# Altium schematic sheet RK3566_DDR_PHY.SchDoc
size A4; SheetNumber: 16; SheetTotal: 20
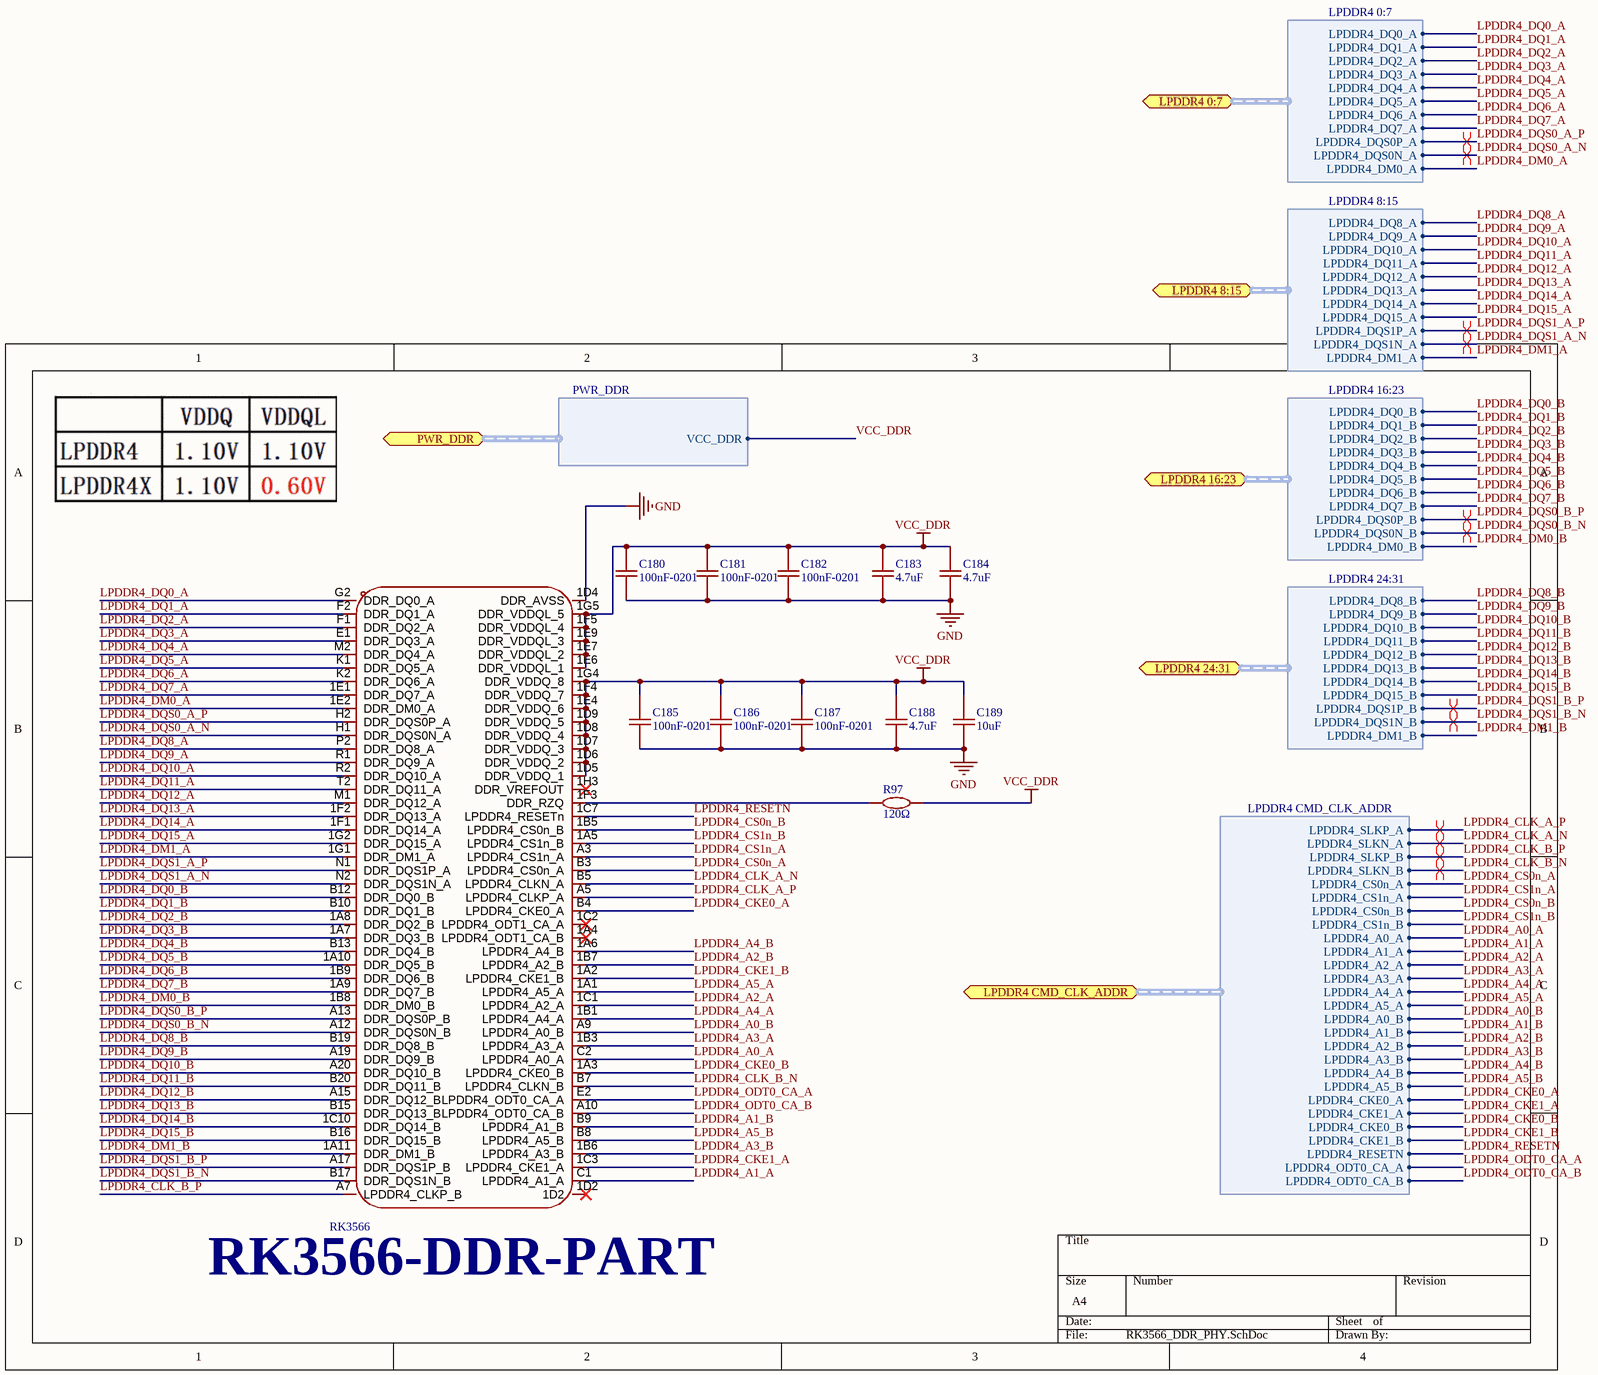
[diagram p0: RK3566_DDR_PHY.SchDoc]

## Parts
C180  100nF-0201  [C0201]
C181  100nF-0201  [C0201]
C182  100nF-0201  [C0201]
C183  4.7uF  [C0402]
C184  4.7uF  [C0402]
C185  100nF-0201  [C0201]
C186  100nF-0201  [C0201]
C187  100nF-0201  [C0201]
C188  4.7uF  [C0402]
C189  10uF  [C0603]
R97  120Ω  [R0402]
U2  RK3566  [BGA-565_L15.5-W14.4-P0.40_RK3566_1]  (part C of 8)

## Ports
LPDDR4 0:7 (bidir, harness LPDDR4 0:7, see RK3566[2A], LPDDR4[7A], RK3566[2A]), LPDDR4 8:15 (bidir, harness LPDDR4 8:15, see RK3566[2A], LPDDR4[7A], RK3566[2A]), LPDDR4 16:23 (bidir, harness LPDDR4 16:23, see RK3566[2A], LPDDR4[7B], RK3566[2A]), LPDDR4 24:31 (bidir, harness LPDDR4 24:31, see RK3566[2A], LPDDR4[7B], RK3566[2A]), LPDDR4 CMD_CLK_ADDR (bidir, harness LPDDR4 CMD_CLK_ADDR, see RK3566[2A], LPDDR4[6C], RK3566[2A]), PWR_DDR (bidir, harness PWR_DDR, see RK3566[2A], POWER[3D], POWER_FLASH_POWER_MANAGE[3B], POWER_PMIC[2D], RK3566[2A])

## Harnesses
PWR_DDR: VCC_DDR
LPDDR4 0:7: LPDDR4_DQ0_A, LPDDR4_DQ1_A, LPDDR4_DQ2_A, LPDDR4_DQ3_A, LPDDR4_DQ4_A, LPDDR4_DQ5_A, LPDDR4_DQ6_A, LPDDR4_DQ7_A, LPDDR4_DQS0P_A, LPDDR4_DQS0N_A, LPDDR4_DM0_A
LPDDR4 8:15: LPDDR4_DQ8_A, LPDDR4_DQ9_A, LPDDR4_DQ10_A, LPDDR4_DQ11_A, LPDDR4_DQ12_A, LPDDR4_DQ13_A, LPDDR4_DQ14_A, LPDDR4_DQ15_A, LPDDR4_DQS1P_A, LPDDR4_DQS1N_A, LPDDR4_DM1_A
LPDDR4 16:23: LPDDR4_DQ0_B, LPDDR4_DQ1_B, LPDDR4_DQ2_B, LPDDR4_DQ3_B, LPDDR4_DQ4_B, LPDDR4_DQ5_B, LPDDR4_DQ6_B, LPDDR4_DQ7_B, LPDDR4_DQS0P_B, LPDDR4_DQS0N_B, LPDDR4_DM0_B
LPDDR4 24:31: LPDDR4_DQ8_B, LPDDR4_DQ9_B, LPDDR4_DQ10_B, LPDDR4_DQ11_B, LPDDR4_DQ12_B, LPDDR4_DQ13_B, LPDDR4_DQ14_B, LPDDR4_DQ15_B, LPDDR4_DQS1P_B, LPDDR4_DQS1N_B, LPDDR4_DM1_B
LPDDR4 CMD_CLK_ADDR: LPDDR4_SLKP_A, LPDDR4_SLKN_A, LPDDR4_SLKP_B, LPDDR4_SLKN_B, LPDDR4_CS0n_A, LPDDR4_CS1n_A, LPDDR4_CS0n_B, LPDDR4_CS1n_B, LPDDR4_A0_A, LPDDR4_A1_A, LPDDR4_A2_A, LPDDR4_A3_A, LPDDR4_A4_A, LPDDR4_A5_A, LPDDR4_A0_B, LPDDR4_A1_B, LPDDR4_A2_B, LPDDR4_A3_B, LPDDR4_A4_B, LPDDR4_A5_B, LPDDR4_CKE0_A, LPDDR4_CKE1_A, LPDDR4_CKE0_B, LPDDR4_CKE1_B, LPDDR4_RESETN, LPDDR4_ODT0_CA_A, LPDDR4_ODT0_CA_B

## Nets
GND: C180.1 C181.1 C182.1 C183.1 C184.1 C185.1 C186.1 C187.1 C188.1 C189.1 U2.1D4(DDR_AVSS)
VCC_DDR: C180.2 C181.2 C182.2 C183.2 C184.2 C185.2 C186.2 C187.2 C188.2 C189.2 R97.2 U2.1D5(DDR_VDDQ_1) U2.1D6(DDR_VDDQ_2) U2.1D7(DDR_VDDQ_3) U2.1D8(DDR_VDDQ_4) U2.1D9(DDR_VDDQ_5) U2.1E4(DDR_VDDQ_6) U2.1E6(DDR_VDDQL_1) U2.1E7(DDR_VDDQL_2) U2.1E9(DDR_VDDQL_3) U2.1F4(DDR_VDDQ_7) U2.1F5(DDR_VDDQL_4) U2.1G4(DDR_VDDQ_8) U2.1G5(DDR_VDDQL_5) ; port PWR_DDR.VCC_DDR
LPDDR4_A0_A: U2.C2(LPDDR4_A0_A) ; port LPDDR4 CMD_CLK_ADDR.LPDDR4_A0_A
LPDDR4_A0_B: U2.A9(LPDDR4_A0_B) ; port LPDDR4 CMD_CLK_ADDR.LPDDR4_A0_B
LPDDR4_A1_A: U2.C1(LPDDR4_A1_A) ; port LPDDR4 CMD_CLK_ADDR.LPDDR4_A1_A
LPDDR4_A1_B: U2.B9(LPDDR4_A1_B) ; port LPDDR4 CMD_CLK_ADDR.LPDDR4_A1_B
LPDDR4_A2_A: U2.1C1(LPDDR4_A2_A) ; port LPDDR4 CMD_CLK_ADDR.LPDDR4_A2_A
LPDDR4_A2_B: U2.1B7(LPDDR4_A2_B) ; port LPDDR4 CMD_CLK_ADDR.LPDDR4_A2_B
LPDDR4_A3_A: U2.1B3(LPDDR4_A3_A) ; port LPDDR4 CMD_CLK_ADDR.LPDDR4_A3_A
LPDDR4_A3_B: U2.1B6(LPDDR4_A3_B) ; port LPDDR4 CMD_CLK_ADDR.LPDDR4_A3_B
LPDDR4_A4_A: U2.1B1(LPDDR4_A4_A) ; port LPDDR4 CMD_CLK_ADDR.LPDDR4_A4_A
LPDDR4_A4_B: U2.1A6(LPDDR4_A4_B) ; port LPDDR4 CMD_CLK_ADDR.LPDDR4_A4_B
LPDDR4_A5_A: U2.1A1(LPDDR4_A5_A) ; port LPDDR4 CMD_CLK_ADDR.LPDDR4_A5_A
LPDDR4_A5_B: U2.B8(LPDDR4_A5_B) ; port LPDDR4 CMD_CLK_ADDR.LPDDR4_A5_B
LPDDR4_CKE0_A: U2.B4(LPDDR4_CKE0_A) ; port LPDDR4 CMD_CLK_ADDR.LPDDR4_CKE0_A
LPDDR4_CKE0_B: U2.1A3(LPDDR4_CKE0_B) ; port LPDDR4 CMD_CLK_ADDR.LPDDR4_CKE0_B
LPDDR4_CKE1_A: U2.1C3(LPDDR4_CKE1_A) ; port LPDDR4 CMD_CLK_ADDR.LPDDR4_CKE1_A
LPDDR4_CKE1_B: U2.1A2(LPDDR4_CKE1_B) ; port LPDDR4 CMD_CLK_ADDR.LPDDR4_CKE1_B
LPDDR4_CLK_A_N: U2.B5(LPDDR4_CLKN_A) ; port LPDDR4 CMD_CLK_ADDR.LPDDR4_SLKN_A
LPDDR4_CLK_A_P: U2.A5(LPDDR4_CLKP_A) ; port LPDDR4 CMD_CLK_ADDR.LPDDR4_SLKP_A
LPDDR4_CLK_B_N: U2.B7(LPDDR4_CLKN_B) ; port LPDDR4 CMD_CLK_ADDR.LPDDR4_SLKN_B
LPDDR4_CLK_B_P: U2.A7(LPDDR4_CLKP_B) ; port LPDDR4 CMD_CLK_ADDR.LPDDR4_SLKP_B
LPDDR4_CS0n_A: U2.B3(LPDDR4_CS0n_A) ; port LPDDR4 CMD_CLK_ADDR.LPDDR4_CS0n_A
LPDDR4_CS0n_B: U2.1B5(LPDDR4_CS0n_B) ; port LPDDR4 CMD_CLK_ADDR.LPDDR4_CS0n_B
LPDDR4_CS1n_A: U2.A3(LPDDR4_CS1n_A) ; port LPDDR4 CMD_CLK_ADDR.LPDDR4_CS1n_A
LPDDR4_CS1n_B: U2.1A5(LPDDR4_CS1n_B) ; port LPDDR4 CMD_CLK_ADDR.LPDDR4_CS1n_B
LPDDR4_DM0_A: U2.1E2(DDR_DM0_A) ; port LPDDR4 0:7.LPDDR4_DM0_A
LPDDR4_DM0_B: U2.1B8(DDR_DM0_B) ; port LPDDR4 16:23.LPDDR4_DM0_B
LPDDR4_DM1_A: U2.1G1(DDR_DM1_A) ; port LPDDR4 8:15.LPDDR4_DM1_A
LPDDR4_DM1_B: U2.1A11(DDR_DM1_B) ; port LPDDR4 24:31.LPDDR4_DM1_B
LPDDR4_DQ0_A: U2.G2(DDR_DQ0_A) ; port LPDDR4 0:7.LPDDR4_DQ0_A
LPDDR4_DQ0_B: U2.B12(DDR_DQ0_B) ; port LPDDR4 16:23.LPDDR4_DQ0_B
LPDDR4_DQ1_A: U2.F2(DDR_DQ1_A) ; port LPDDR4 0:7.LPDDR4_DQ1_A
LPDDR4_DQ1_B: U2.B10(DDR_DQ1_B) ; port LPDDR4 16:23.LPDDR4_DQ1_B
LPDDR4_DQ2_A: U2.F1(DDR_DQ2_A) ; port LPDDR4 0:7.LPDDR4_DQ2_A
LPDDR4_DQ2_B: U2.1A8(DDR_DQ2_B) ; port LPDDR4 16:23.LPDDR4_DQ2_B
LPDDR4_DQ3_A: U2.E1(DDR_DQ3_A) ; port LPDDR4 0:7.LPDDR4_DQ3_A
LPDDR4_DQ3_B: U2.1A7(DDR_DQ3_B) ; port LPDDR4 16:23.LPDDR4_DQ3_B
LPDDR4_DQ4_A: U2.M2(DDR_DQ4_A) ; port LPDDR4 0:7.LPDDR4_DQ4_A
LPDDR4_DQ4_B: U2.B13(DDR_DQ4_B) ; port LPDDR4 16:23.LPDDR4_DQ4_B
LPDDR4_DQ5_A: U2.K1(DDR_DQ5_A) ; port LPDDR4 0:7.LPDDR4_DQ5_A
LPDDR4_DQ5_B: U2.1A10(DDR_DQ5_B) ; port LPDDR4 16:23.LPDDR4_DQ5_B
LPDDR4_DQ6_A: U2.K2(DDR_DQ6_A) ; port LPDDR4 0:7.LPDDR4_DQ6_A
LPDDR4_DQ6_B: U2.1B9(DDR_DQ6_B) ; port LPDDR4 16:23.LPDDR4_DQ6_B
LPDDR4_DQ7_A: U2.1E1(DDR_DQ7_A) ; port LPDDR4 0:7.LPDDR4_DQ7_A
LPDDR4_DQ7_B: U2.1A9(DDR_DQ7_B) ; port LPDDR4 16:23.LPDDR4_DQ7_B
LPDDR4_DQ8_A: U2.P2(DDR_DQ8_A) ; port LPDDR4 8:15.LPDDR4_DQ8_A
LPDDR4_DQ8_B: U2.B19(DDR_DQ8_B) ; port LPDDR4 24:31.LPDDR4_DQ8_B
LPDDR4_DQ9_A: U2.R1(DDR_DQ9_A) ; port LPDDR4 8:15.LPDDR4_DQ9_A
LPDDR4_DQ9_B: U2.A19(DDR_DQ9_B) ; port LPDDR4 24:31.LPDDR4_DQ9_B
LPDDR4_DQ10_A: U2.R2(DDR_DQ10_A) ; port LPDDR4 8:15.LPDDR4_DQ10_A
LPDDR4_DQ10_B: U2.A20(DDR_DQ10_B) ; port LPDDR4 24:31.LPDDR4_DQ10_B
LPDDR4_DQ11_A: U2.T2(DDR_DQ11_A) ; port LPDDR4 8:15.LPDDR4_DQ11_A
LPDDR4_DQ11_B: U2.B20(DDR_DQ11_B) ; port LPDDR4 24:31.LPDDR4_DQ11_B
LPDDR4_DQ12_A: U2.M1(DDR_DQ12_A) ; port LPDDR4 8:15.LPDDR4_DQ12_A
LPDDR4_DQ12_B: U2.A15(DDR_DQ12_B) ; port LPDDR4 24:31.LPDDR4_DQ12_B
LPDDR4_DQ13_A: U2.1F2(DDR_DQ13_A) ; port LPDDR4 8:15.LPDDR4_DQ13_A
LPDDR4_DQ13_B: U2.B15(DDR_DQ13_B) ; port LPDDR4 24:31.LPDDR4_DQ13_B
LPDDR4_DQ14_A: U2.1F1(DDR_DQ14_A) ; port LPDDR4 8:15.LPDDR4_DQ14_A
LPDDR4_DQ14_B: U2.1C10(DDR_DQ14_B) ; port LPDDR4 24:31.LPDDR4_DQ14_B
LPDDR4_DQ15_A: U2.1G2(DDR_DQ15_A) ; port LPDDR4 8:15.LPDDR4_DQ15_A
LPDDR4_DQ15_B: U2.B16(DDR_DQ15_B) ; port LPDDR4 24:31.LPDDR4_DQ15_B
LPDDR4_DQS0_A_N: U2.H1(DDR_DQS0N_A) ; port LPDDR4 0:7.LPDDR4_DQS0N_A
LPDDR4_DQS0_A_P: U2.H2(DDR_DQS0P_A) ; port LPDDR4 0:7.LPDDR4_DQS0P_A
LPDDR4_DQS0_B_N: U2.A12(DDR_DQS0N_B) ; port LPDDR4 16:23.LPDDR4_DQS0N_B
LPDDR4_DQS0_B_P: U2.A13(DDR_DQS0P_B) ; port LPDDR4 16:23.LPDDR4_DQS0P_B
LPDDR4_DQS1_A_N: U2.N2(DDR_DQS1N_A) ; port LPDDR4 8:15.LPDDR4_DQS1N_A
LPDDR4_DQS1_A_P: U2.N1(DDR_DQS1P_A) ; port LPDDR4 8:15.LPDDR4_DQS1P_A
LPDDR4_DQS1_B_N: U2.B17(DDR_DQS1N_B) ; port LPDDR4 24:31.LPDDR4_DQS1N_B
LPDDR4_DQS1_B_P: U2.A17(DDR_DQS1P_B) ; port LPDDR4 24:31.LPDDR4_DQS1P_B
LPDDR4_ODT0_CA_A: U2.E2(LPDDR4_ODT0_CA_A) ; port LPDDR4 CMD_CLK_ADDR.LPDDR4_ODT0_CA_A
LPDDR4_ODT0_CA_B: U2.A10(LPDDR4_ODT0_CA_B) ; port LPDDR4 CMD_CLK_ADDR.LPDDR4_ODT0_CA_B
LPDDR4_RESETN: U2.1C7(LPDDR4_RESETn) ; port LPDDR4 CMD_CLK_ADDR.LPDDR4_RESETN
NetR97_1: R97.1 U2.1F3(DDR_RZQ)

Not connected (* = marked no-connect by the designer): U2 1A4(LPDDR4_ODT1_CA_B)* 1C2(LPDDR4_ODT1_CA_A)* 1D2* 1H3(DDR_VREFOUT)*

## Layout directives
differential pair: LPDDR4_CLK_A_N, LPDDR4_CLK_A_P, LPDDR4_CLK_B_N, LPDDR4_CLK_B_P, LPDDR4_DQS0_A_N, LPDDR4_DQS0_A_P, LPDDR4_DQS0_B_N, LPDDR4_DQS0_B_P, LPDDR4_DQS1_A_N, LPDDR4_DQS1_A_P, LPDDR4_DQS1_B_N, LPDDR4_DQS1_B_P

## Notes on the sheet
- (near U2) RK3566-DDR-PART

## Library data of the parts
C180-C182 C185-C187 = 100nF-0201: CL03A104KO3NNNC
C183 C184 C188 = 4.7uF: 10V 4.7uF X5R ±20% 0402 Ceramic Capacitors ROHS
C189 = 10uF: 10V 10uF X5R ±10% 0603 Ceramic Capacitors ROHS
R97 = 120Ω: 62.5mW 120Ω 50V ±100ppm/℃ Thick Film Resistor ±1% 0402 Chip Resistor - Surface Mount ROHS
U2 = RK3566: BGA-565(15.5x14.4); Symbol: RK3566